# Altium schematic sheet POWER_4.SchDoc
size 420 x 297 mm; SheetNumber: 10; SheetTotal: 24
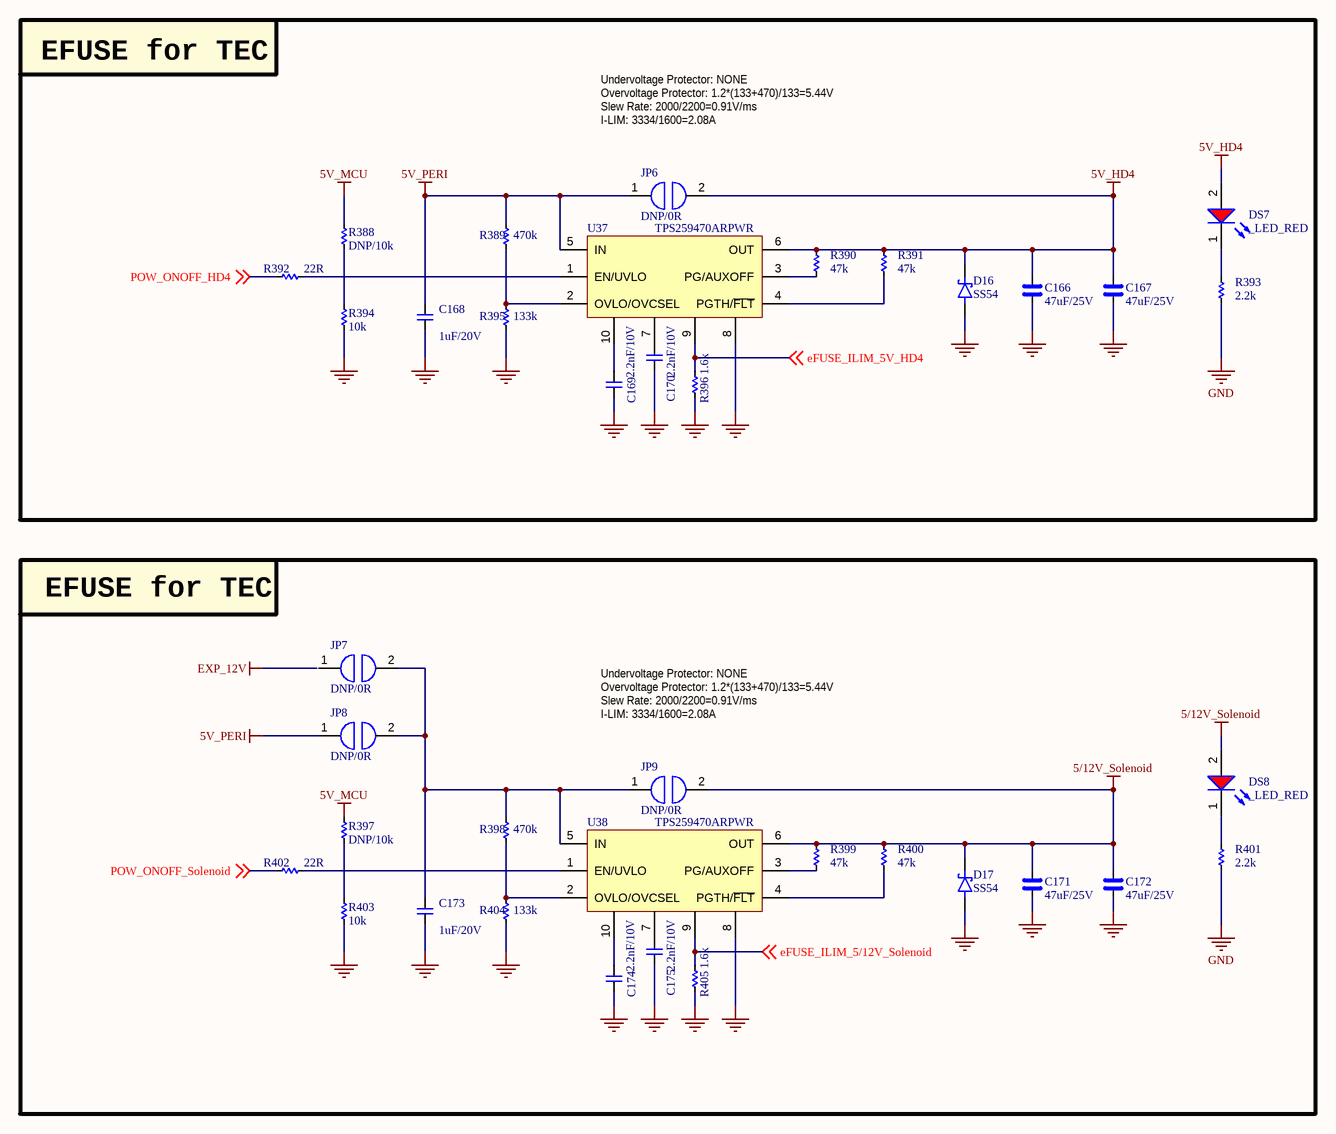
[diagram p0: POWER_4.SchDoc]

## Parts
C166  47uF/25V  [CAP_C_3225X80]
C167  47uF/25V  [CAP_C_3225X80]
C168  1uF/20V  [CAP_C_1005X60]
C169  2.2nF/10V  [CAP_C_1005X60]
C170  2.2nF/10V  [CAP_C_1005X60]
C171  47uF/25V  [CAP_C_3225X80]
C172  47uF/25V  [CAP_C_3225X80]
C173  1uF/20V  [CAP_C_1005X60]
C174  2.2nF/10V  [CAP_C_1005X60]
C175  2.2nF/10V  [CAP_C_1005X60]
D16  SS54  [DO-214AC_SMA]
D17  SS54  [DO-214AC_SMA]
DS7  _LED_RED  [LED_0402]
DS8  _LED_RED  [LED_0402]
JP6  DNP/0R  [RES_C_1608X60]
JP7  DNP/0R  [RES_C_1608X60]
JP8  DNP/0R  [RES_C_1608X60]
JP9  DNP/0R  [RES_C_1608X60]
R388  DNP/10k  [RES_C_1005X40]
R389  470k  [RES_C_1005X40]
R390  47k  [RES_C_1005X40]
R391  47k  [RES_C_1005X40]
R392  22R  [RES_C_1005X40]
R393  2.2k  [RES_C_1005X40]
R394  10k  [RES_C_1005X40]
R395  133k  [RES_C_1005X40]
R396  1.6k  [RES_C_1005X40]
R397  DNP/10k  [RES_C_1005X40]
R398  470k  [RES_C_1005X40]
R399  47k  [RES_C_1005X40]
R400  47k  [RES_C_1005X40]
R401  2.2k  [RES_C_1005X40]
R402  22R  [RES_C_1005X40]
R403  10k  [RES_C_1005X40]
R404  133k  [RES_C_1005X40]
R405  1.6k  [RES_C_1005X40]
U37  TPS259470ARPWR  [VQFN-HR-10]
U38  TPS259470ARPWR  [VQFN-HR-10]

## Blocks framed on the sheet
EFUSE for TEC: C166-C170 D16 DS7 JP6 R388-R396 U37
EFUSE for TEC: C171-C175 D17 DS8 JP7-JP9 R397-R405 U38

## Nets
5/12V_Solenoid: C171.2 C172.2 D17.1(K) DS8.2(A) JP9.2 R399.2 R400.2 U38.6(OUT)
5V_HD4: C166.2 C167.2 D16.1(K) DS7.2(A) JP6.2 R390.2 R391.2 U37.6(OUT)
5V_MCU: R388.1 R397.1
5V_PERI: C168.2 JP6.1 JP8.1 R389.2 U37.5(IN)
GND: C166.1 C167.1 C168.1 C169.1 C170.1 C171.1 C172.1 C173.1 C174.1 C175.1 D16.2(A) D17.2(A) R393.1 R394.2 R395.1 R396.1 R401.1 R403.2 R404.1 R405.1 U37.8 U38.8
eFUSE_ILIM_5/12V_Solenoid: R405.2 U38.9 ; off-sheet eFUSE_ILIM_5/12V_Solenoid
eFUSE_ILIM_5V_HD4: R396.2 U37.9 ; off-sheet eFUSE_ILIM_5V_HD4
POW_ONOFF_HD4: R392.2 ; off-sheet POW_ONOFF_HD4
POW_ONOFF_Solenoid: R402.2 ; off-sheet POW_ONOFF_Solenoid
NetC169_2: C169.2 U37.10
NetC170_2: C170.2 U37.7
NetC173_2: C173.2 JP7.2 JP8.2 JP9.1 R398.2 U38.5(IN)
NetC174_2: C174.2 U38.10
NetC175_2: C175.2 U38.7
NetDS7_1: DS7.1(K) R393.2
NetDS8_1: DS8.1(K) R401.2
NetR388_2: R388.2 R394.1
NetR389_1: R389.1 R395.2 U37.2(OVLO/OVCSEL)
NetR390_1: R390.1 U37.3(PG/AUXOFF)
NetR391_1: R391.1 U37.4(PGTH/~{FLT})
NetR392_1: R392.1 U37.1(EN/UVLO)
NetR397_2: R397.2 R403.1
NetR398_1: R398.1 R404.2 U38.2(OVLO/OVCSEL)
NetR399_1: R399.1 U38.3(PG/AUXOFF)
NetR400_1: R400.1 U38.4(PGTH/~{FLT})
NetR402_1: R402.1 U38.1(EN/UVLO)

Not connected (* = marked no-connect by the designer): JP7 1

## Notes on the sheet
- Undervoltage Protector: NONE
- Overvoltage Protector: 1.2*(133+470)/133=5.44V
- Slew Rate: 2000/2200=0.91V/ms
- I-LIM: 3334/1600=2.08A
- Project:
- BEE-PC1
- Sub-system:
- NANORACK_EXP_CONTROLLER
- Design by:
- SANG HUYNH
- BAO BUI Q.
- Sheet title:
- Sheet
- A3
- of
- Checked by:
- Approved by:
- VU PHAM
- Revision:
- Document No:
- V1.2.2
- Size:
- Date:

## Library data of the parts
C166 C167 C171 C172 = _CAP_C_High_2: CAP CHIP High Value
C168-C170 C173-C175 = _CAP_C_2: CAP CHIP
D16 D17 = DIODE SCHOTTKY
JP6-JP9 = JUMPER
R388-R405 = _RES_B_2: RES